# EAGLE design 34064-test-board (EAGLE 9.4.2)
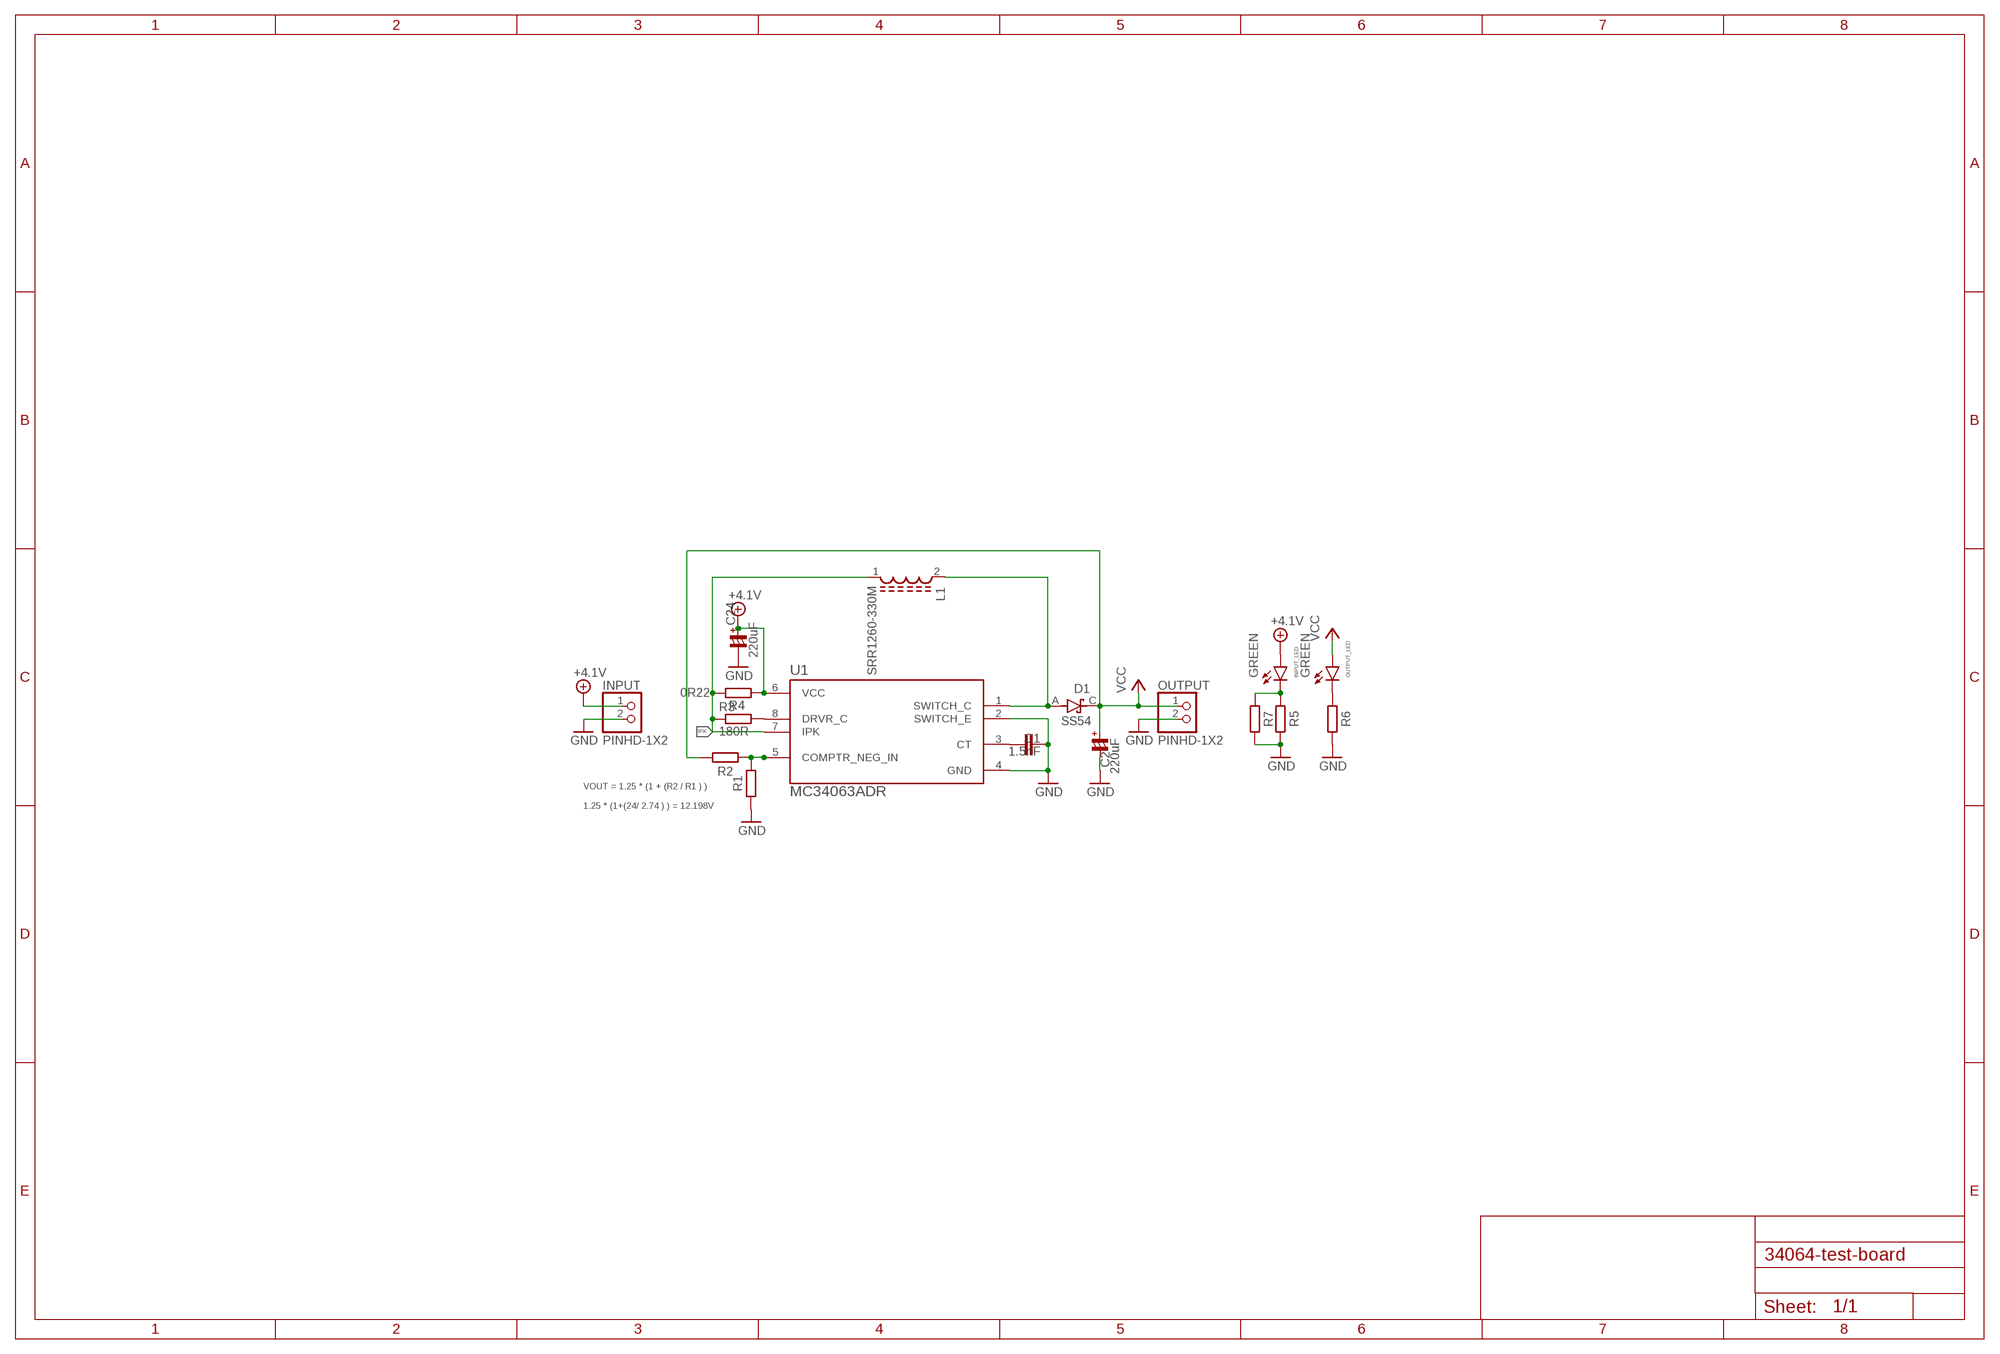
[diagram p0: schematic, sheet 1]

## Parts
C1  1.5nF  C-EUC0603  [C0603]
C2  220uF  RC-MASTER-SMD_CP_7343-43  [RC-MASTER-SMD_C7343-43]
C24  220uF  RC-MASTER-SMD_CP_7343-43  [RC-MASTER-SMD_C7343-43]
D1  SS54  [DIOM5336X265N]
INPUT  PINHD-1X2  [1X02]
INPUT_LED  GREEN  LEDCHIPLED_0603  [CHIPLED_0603]
L1  SRR1260-330M  [INDP125125X600N]
OUTPUT  PINHD-1X2  [1X02]
OUTPUT_LED  GREEN  LEDCHIPLED_0603  [CHIPLED_0603]
R1  2K2  R-EU_R0402  [R0402]
R2  20K  R-EU_R0402  [R0402]
R3  180R  R-EU_R0603  [R0603]
R4  0R22  R-EU_R0805  [R0805]
R5  2K74  R-EU_R0402  [R0402]
R6  2K74  R-EU_R0402  [R0402]
R7  2K74  R-EU_R0402  [R0402]
U1  MC34063ADR  [SOIC127P599X175-8N]

## Nets
+4.1V: C24.+ INPUT.1 INPUT_LED.A R4.2 U1.6(VCC)
GND: C1.2 C2.- C24.- INPUT.2 OUTPUT.2 R1.2 R5.1 R6.1 R7.1 U1.2(SWITCH_E) U1.4(GND)
IPK: L1.1 R3.1 R4.1 U1.7(IPK)
N$1: R1.1 R2.2 U1.5(COMPTR_NEG_IN)
N$2: INPUT_LED.C R5.2 R7.2
N$3: D1.A L1.2 U1.1(SWITCH_C)
N$4: C1.1 U1.3(CT)
N$5: OUTPUT_LED.C R6.2
N$6: R3.2 U1.8(DRVR_C)
VCC: C2.+ D1.C(K) OUTPUT.1 OUTPUT_LED.A R2.1

## Notes on the sheet
- VOUT = 1.25 * (1 + (R2 / R1 ) )
  
  1.25 * (1+(24/ 2.74 ) ) = 12.198V

## Library data of the parts
C1 = rcl:C-EU: CAPACITOR, European symbol; SPICEPREFIX: C
C2 C24 = 52101-101-REV-A:RC-MASTER-SMD_CP_: POLARIZED CAP
D1 = SS54:SS54: Diode Schottky 40V 2A Surface Mount DO-214AA (SMB) Check prices <https://pricing.snapeda.com/parts/SS24/ON%20Semiconductor/view-part?ref=eda>; AVAILABILITY: In Stock; DESCRIPTION: Diode Schottky 40V 2A Surface Mount DO-214AC (SMA); MF: ON Semiconductor; MP: SS24; PACKAGE: DO-214AA ON Semiconductor; PRICE: None
INPUT OUTPUT = Connector:PINHD-1X2: PIN HEADER; CATEGORY: CONNECTOR; SUB-CATEGORY: PIN-HEADER
INPUT_LED OUTPUT_LED = led:LED: LED OSRAM: - CHIPLED LG R971, LG N971, LY N971, LG Q971, LY Q971, LO R971, LY R971 LH N974, LH R974 LS Q976, LO Q976, LY Q976 LO Q996 - Hyper CHIPLED LW Q18S LB Q993, LB Q99A, LB R99A - SideLED LS A670, LO A670, LY A670, LG A670, LP A670 LB A673, LV A673, LT A673, LW A673 LH A674 LY A675 LS A676, LA A676, LO A676, LY A676, LW A676 LS A679, LY A679, LG A679 - Hyper Micro SIDELED® LS Y876, LA Y876, LO Y876, LY Y876 LT Y87S - SmartLED LW L88C, LW L88S LB L89C, LB L89S, LG L890 LS L89K, LO L89K, LY L89K LS L896, LA L896, LO L896, LY L896 - TOPLED LS T670, LO T670, LY T670, LG T670, LP T670 LSG T670, LSP T670, LSY T670, LOP T670, LYG T670 LG T671, LOG T671, LSG T671 LB T673, LV T673, LT T673, LW T673 LH T674 LS T676, LA T676, LO T676, LY T676, LB T676, LH T676, LSB T676, LW T676 LB T67C, LV T67C, LT T67C, LS T67K, LO T67K, LY T67K, LW E67C LS E67B, LA E67B, LO E67B, LY E67B, LB E67C, LV E67C, LT E67C LW T67C LS T679, LY T679, LG T679 LS T770, LO T770, LY T770, LG T770, LP T770 LB T773, LV T773, LT T773, LW T773 LH T774 LS E675, LA E675, LY E675, LS T675 LS T776, LA T776, LO T776, LY T776, LB T776 LHGB T686 LT T68C, LB T68C - Hyper Mini TOPLED® LB M676 - Mini TOPLED Santana® LG M470 LS M47K, LO M47K, LY M47K Source: http://www.osram.convergy.de LUXEON: - LUMILED® LXK2-PW12-R00, LXK2-PW12-S00, LXK2-PW14-U00, LXK2-PW14-V00 LXK2-PM12-R00, LXK2-PM12-S00, LXK2-PM14-U00 LXK2-PE12-Q00, LXK2-PE12-R00, LXK2-PE12-S00, LXK2-PE14-T00, LXK2-PE14-U00 LXK2-PB12-K00, LXK2-PB12-L00, LXK2-PB12-M00, LXK2-PB14-N00, LXK2-PB14-P00, LXK2-PB14-Q00 LXK2-PR12-L00, LXK2-PR12-M00, LXK2-PR14-Q00, LXK2-PR14-R00 LXK2-PD12-Q00, LXK2-PD12-R00, LXK2-PD12-S00 LXK2-PH12-R00, LXK2-PH12-S00 LXK2-PL12-P00, LXK2-PL12-Q00, LXK2-PL12-R00 Source: www.luxeon.com KINGBRIGHT: KA-3528ASYC Source: www.kingbright.com
L1 = SRR1260-330M:SRR1260-330M: Inductor Power Shielded Wirewound 33uH 20% 100KHz 27Q-Factor Ferrite 3A 60mOhm DCR T/R Check availability <https://pricing.snapeda.com/parts/SRR1260-330M/Bourns/view-part?ref=eda>; AVAILABILITY: In Stock; DESCRIPTION: 33 µH Shielded Drum Core, Wirewound Inductor 3 A 60mOhm Max Nonstandard; MF: Bourns; MP: SRR1260-330M; PACKAGE: Nonstandard Bourns; PRICE: None; PURCHASE-URL: https://pricing.snapeda.com/search/part/SRR1260-330M/?ref=eda
R1-R3 R5-R7 = resistors-scott:R-EU_: RESISTOR, European symbol; SPICEPREFIX: R
R4 = rcl:R-EU_: RESISTOR, European symbol; SPICEPREFIX: R
U1 = MC34063ADR:MC34063ADR: 1.5-A Boost/Buck/Inverting Switching Regulator 8-SOIC 0 to 70 Check prices <https://pricing.snapeda.com/parts/MC34063ADR/Texas%20Instruments/view-part?ref=eda>; AVAILABILITY: Warning; DESCRIPTION: 1.5-A Boost/Buck/Inverting Switching Regulator 8-SOIC 0 to 70; MF: Texas Instruments; MP: MC34063ADR; PACKAGE: SOIC-8 Texas Instruments; PRICE: None; PURCHASE-URL: https://pricing.snapeda.com/search/part/MC34063ADR/?ref=eda

## Board
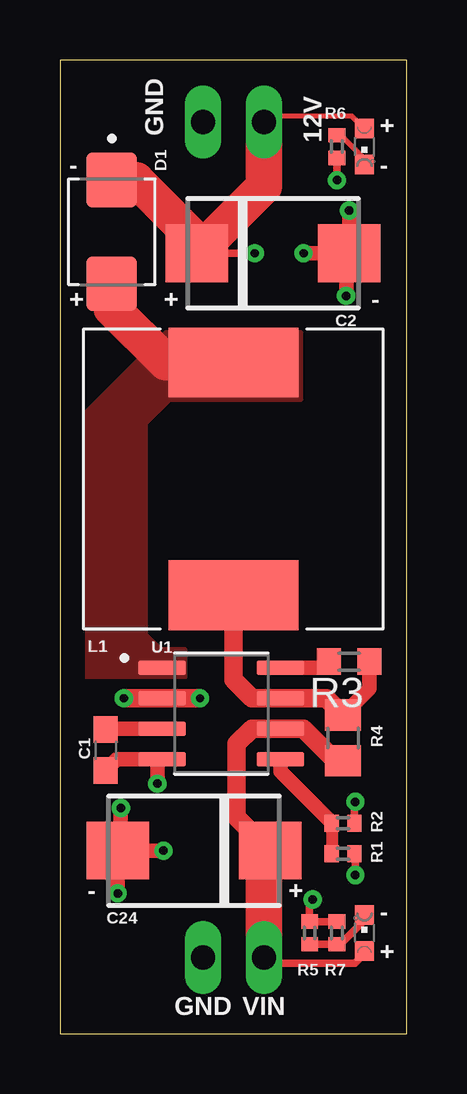
[diagram p1: board, top side]
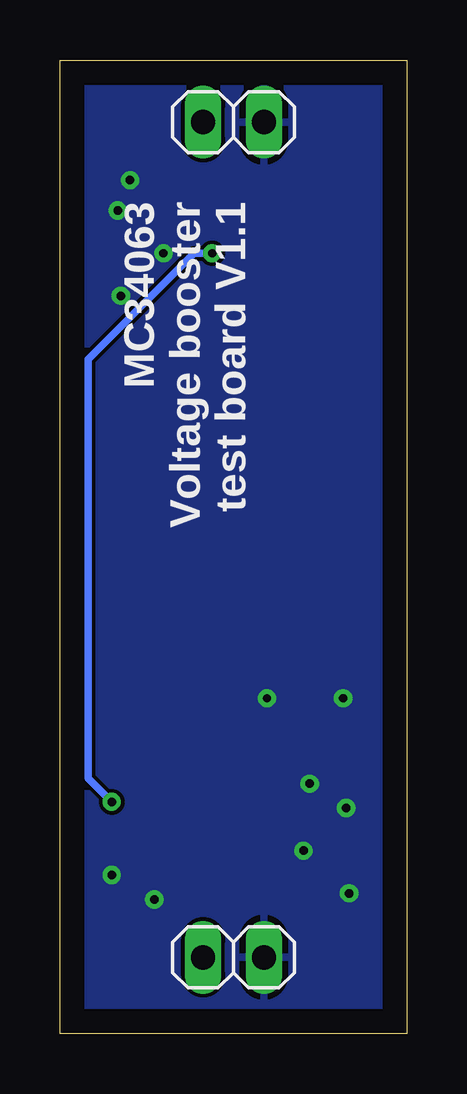
[diagram p2: board, bottom side, seen from below]

Size 14.48 x 40.56 mm. Coordinates in mm from the lower left corner, seen from the top.
Outline: 0,0 14.48,0 14.48,40.56 0,40.56 0,0
Copper layers (1*16): Top 0.035mm / dielectric 0.15mm / Bottom 0.035mm
Design rules "default": minimum track width 6mil, minimum drill 0.35mm, track to track 6mil, track to pad 6mil, pad to pad 6mil, via to via 6mil, smd to smd 6mil, copper to edge 40mil, drill to drill 6mil, minimum pad ring 10mil, minimum via ring 8mil, stop-mask expansion 4mil, vias tented up to drill 0mil, thermal gap 10mil

### Footprints (pad centres in the part's own frame; a part is rotated, then mirrored left to right if it is on the bottom)
C0603 = smd 1.1 x 1: 1 -0.85,0; 2 0.85,0
RC-MASTER-SMD_C7343-43 = smd 2.6 x 2.4: + 3.175,0; - -3.175,0
DIOM5336X265N = smd 2.29 x 2.12: A 2.16,0; C -2.16,0
1X02 = drill 1.016 long: 1 -1.27,0; 2 1.27,0
CHIPLED_0603 = smd 0.8 x 0.8: A 0,-0.75; C 0,0.75
INDP125125X600N = smd 2.9 x 5.4: 1 -4.85,0; 2 4.85,0
R0402 = smd 0.6 x 0.7: 1 -0.47,0; 2 0.47,0
R0603 = smd 1 x 1.1: 1 -0.85,0; 2 0.85,0
R0805 = smd 1.3 x 1.5: 1 -0.95,0; 2 0.95,0
SOIC127P599X175-8N = smd 1.97 x 0.6: 1 -2.47,1.905; 2 -2.47,0.635; 3 -2.47,-0.635; 4 -2.47,-1.905; 5 2.47,-1.905; 6 2.47,-0.635; 7 2.47,0.635; 8 2.47,1.905

### Placement (x,y rotation side)
C1  1.91,11.81 270 top
C2  8.89,32.51 180 top
C24  5.59,7.62 0 top
D1  2.16,33.4 270 top
INPUT  7.24,3.17 0 bottom
INPUT_LED  12.7,4.19 0 top
L1  7.24,23.11 90 top
OUTPUT  7.24,37.97 0 bottom
OUTPUT_LED  12.7,36.96 180 top
R1  11.81,7.49 0 top
R2  11.81,8.76 180 top
R3  12.06,15.49 180 top
R4  11.81,12.32 270 top
R5  10.41,4.19 270 top
R6  11.56,36.96 90 top
R7  11.56,4.19 270 top
U1  6.73,13.33 0 top

### Tracks (layer width: path | path; a pad name or v marks a point on that pad's centre or on a via)
+4.1V
  Top 0.305: INPUT_LED.A 12.7,3.31 12.31,2.92 8.76,2.92 INPUT.1
  Top 0.762: C24.+ 7.37,9.02 7.37,12.06 8,12.7 U1.6 10.16,12.7 11.49,11.37 R4.2
  Top 1.524: INPUT.1 8.51,7.37 C24.+
GND  (via drill 0.35)
  Top 0.305: R1.2 12.32,7.46 v12.32,6.6 | R6.1 v11.56,35.56 | R7.1 R5.1 10.41,5.46 v10.54,5.59 | 4.06,11.23 U1.4
  Top 0.508: C24.- 2.54,7.75 | C2.- 11.94,32.38
  Top 0.61: v4.32,7.62 C24.- v2.41,5.84 | 2.54,7.75 v2.54,9.4 | v10.16,32.51 C2.- v12.06,34.29 | 11.94,32.38 v11.94,30.73 | v4.06,10.41 4.06,11.23 | C1.2 2.37,11.43 U1.4
  Top 0.762: v2.67,13.97 U1.2 v5.84,13.97
  pour Bottom: -2.54,41.15 17.78,41.15 17.78,-1.91 -2.54,-1.91
IPK
  Top 0.61: R4.1 12.91,14.37 R3.1
  Top 0.762: R4.1 11.11,13.97 U1.7 8,13.97 7.24,14.73 L1.1
N$1
  Top 0.508: R2.2 R1.1
  Top 0.61: U1.5 9.2,10.92 11.34,8.78 R2.2
N$2
  Top 0.305: INPUT_LED.C 12.7,4.72 11.7,3.72 R7.2 R5.2
N$3
  Top 1.524: L1.2 4.42,27.96 2.16,30.23 D1.A
  pour Top (no thermals): 5.21,14.86 1.02,14.86 1.02,25.78 4.45,29.21 10.03,29.21 10.03,26.42 4.57,26.42 3.56,25.4 3.56,16.64 4.19,16 5.21,16
N$4
  Top 0.61: C1.1 1.92,12.7 U1.3
N$5
  Top 0.203: R6.2 11.72,37.43 12.7,36.45 OUTPUT_LED.C
N$6
  Top 0.61: U1.8 10.96,15.24 R3.2
VCC  (via drill 0.35)
  Top 0.203: OUTPUT_LED.A 12.18,38.23 8.76,38.23 OUTPUT.1
  Top 0.305: C2.+ v8.13,32.51 | R2.1 12.28,9.61 v12.32,9.65
  Top 1.524: D1.C 3.17,35.56 5.71,33.02 C2.+ 8.51,35.31 OUTPUT.1
  Bottom 0.305: v12.32,9.65 13.31,10.64 13.31,28.09 8.89,32.51 v8.13,32.51

### Text on the board
tPlace: GND | 12V | + | - | - | + | + | - | - | + | - | + | GND | VIN
bPlace: MC34063 / Voltage booster / test board V1.1